# EAGLE design Werkstatt Provisions v.09 (EAGLE 6.2)

## Sheet 1 of 2
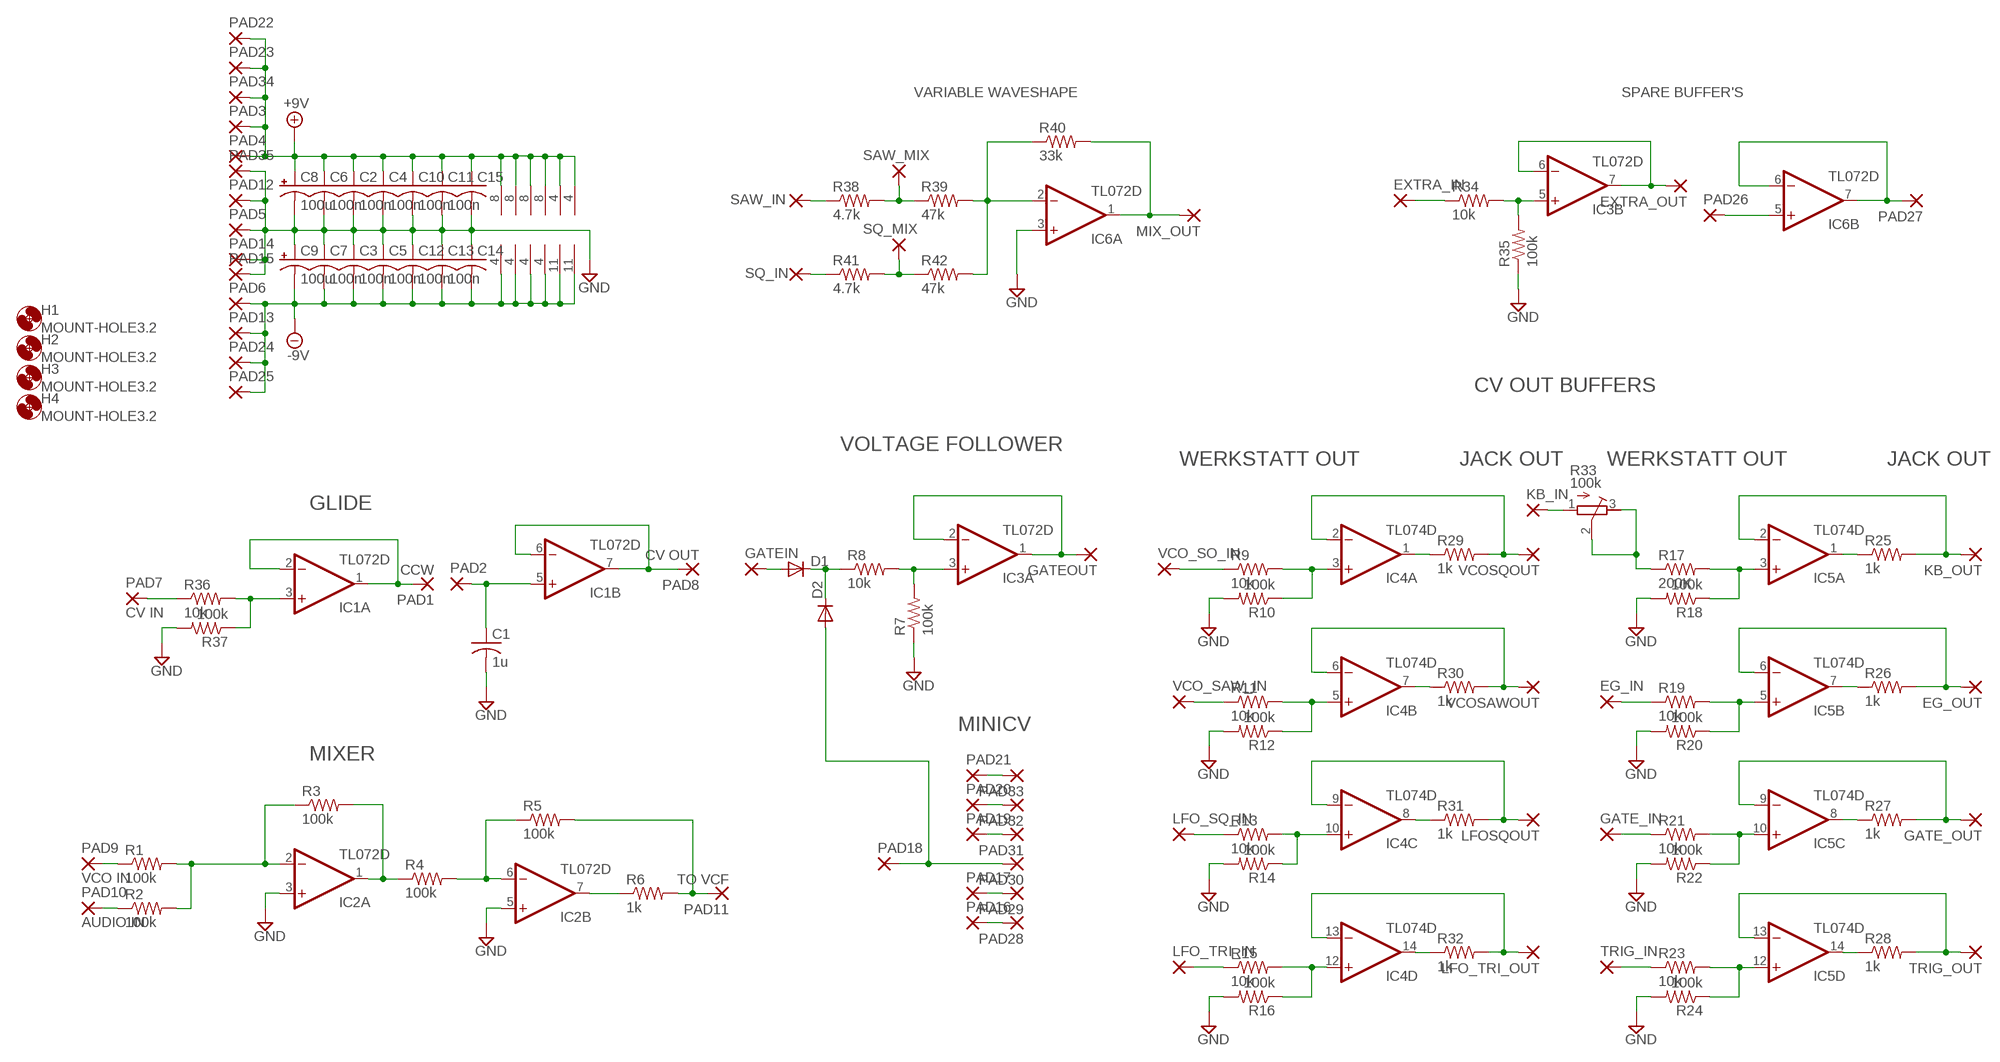
[diagram p0: schematic, sheet 1]

### Parts
C1  1u  C-USC0805K  [C0805K]
C2  100n  C-USC0805K  [C0805K]
C3  100n  C-USC0805K  [C0805K]
C4  100n  C-USC0805K  [C0805K]
C5  100n  C-USC0805K  [C0805K]
C6  100n  C-USC0805K  [C0805K]
C7  100n  C-USC0805K  [C0805K]
C8  100u  CPOL-USD  [PANASONIC_D]
C9  100u  CPOL-USD  [PANASONIC_D]
C10  100n  C-USC0805K  [C0805K]
C11  100n  C-USC0805K  [C0805K]
C12  100n  C-USC0805K  [C0805K]
C13  100n  C-USC0805K  [C0805K]
C14  C-USC0805  [C0805]
C15  C-USC0805  [C0805]
D1  DIODE-SOD323-W  [SOD323-W]
D2  DIODE-SOD323-W  [SOD323-W]
EG_IN  2,0/0,9-O  [2,0/0,9-O]
EG_OUT  2,0/0,9-O  [2,0/0,9-O]
EXTRA_IN  2,0/0,9-O  [2,0/0,9-O]
EXTRA_OUT  2,0/0,9-O  [2,0/0,9-O]
GATE_IN  2,0/0,9-O  [2,0/0,9-O]
GATE_OUT  2,0/0,9-O  [2,0/0,9-O]
GATEIN  2,0/0,9-O  [2,0/0,9-O]
GATEOUT  2,0/0,9-O  [2,0/0,9-O]
H1  MOUNT-HOLE3.2  [3,2]
H2  MOUNT-HOLE3.2  [3,2]
H3  MOUNT-HOLE3.2  [3,2]
H4  MOUNT-HOLE3.2  [3,2]
IC1  TL072D  [SO08]
IC2  TL072D  [SO08]
IC3  TL072D  [SO08]
IC4  TL074D  [SO14]
IC5  TL074D  [SO14]
IC6  TL072D  [SO08]
KB_IN  2,0/0,9-O  [2,0/0,9-O]
KB_OUT  2,0/0,9-O  [2,0/0,9-O]
LFO_SQ_IN  2,0/0,9-O  [2,0/0,9-O]
LFO_TRI_IN  2,0/0,9-O  [2,0/0,9-O]
LFO_TRI_OUT  2,0/0,9-O  [2,0/0,9-O]
LFOSQOUT  2,0/0,9-O  [2,0/0,9-O]
MIX_OUT  2,0/0,9-O  [2,0/0,9-O]
PAD1  CCW  2,0/0,9-O  [2,0/0,9-O]
PAD2  2,0/0,9-O  [2,0/0,9-O]
PAD3  2,0/0,9-O  [2,0/0,9-O]
PAD4  2,0/0,9-O  [2,0/0,9-O]
PAD5  2,0/0,9-O  [2,0/0,9-O]
PAD6  2,0/0,9-O  [2,0/0,9-O]
PAD7  CV IN  2,0/0,9-O  [2,0/0,9-O]
PAD8  CV OUT  2,0/0,9-O  [2,0/0,9-O]
PAD9  VCO IN  2,0/0,9-O  [2,0/0,9-O]
PAD10  AUDIO IN  2,0/0,9-O  [2,0/0,9-O]
PAD11  TO VCF  2,0/0,9-O  [2,0/0,9-O]
PAD12  2,0/0,9-O  [2,0/0,9-O]
PAD13  2,0/0,9-O  [2,0/0,9-O]
PAD14  2,0/0,9-O  [2,0/0,9-O]
PAD15  2,0/0,9-O  [2,0/0,9-O]
PAD16  2,0/0,9-O  [2,0/0,9-O]
PAD17  2,0/0,9-O  [2,0/0,9-O]
PAD18  2,0/0,9-O  [2,0/0,9-O]
PAD19  2,0/0,9-O  [2,0/0,9-O]
PAD20  2,0/0,9-O  [2,0/0,9-O]
PAD21  2,0/0,9-O  [2,0/0,9-O]
PAD22  2,0/0,9-O  [2,0/0,9-O]
PAD23  2,0/0,9-O  [2,0/0,9-O]
PAD24  2,0/0,9-O  [2,0/0,9-O]
PAD25  2,0/0,9-O  [2,0/0,9-O]
PAD26  2,0/0,9-O  [2,0/0,9-O]
PAD27  2,0/0,9-O  [2,0/0,9-O]
PAD28  1,6/0,8  [1,6/0,8]
PAD29  1,6/0,8  [1,6/0,8]
PAD30  1,6/0,8  [1,6/0,8]
PAD31  1,6/0,8  [1,6/0,8]
PAD32  1,6/0,8  [1,6/0,8]
PAD33  1,6/0,8  [1,6/0,8]
PAD34  1,6/0,8  [1,6/0,8]
PAD35  1,6/0,8  [1,6/0,8]
R1  100k  R-US_M0805  [M0805]
R2  100k  R-US_M0805  [M0805]
R3  100k  R-US_M0805  [M0805]
R4  100k  R-US_M0805  [M0805]
R5  100k  R-US_M0805  [M0805]
R6  1k  R-US_M0805  [M0805]
R7  100k  R-US_M0805  [M0805]
R8  10k  R-US_M0805  [M0805]
R9  10k  R-US_M0805  [M0805]
R10  100k  R-US_M0805  [M0805]
R11  10k  R-US_M0805  [M0805]
R12  100k  R-US_M0805  [M0805]
R13  10k  R-US_M0805  [M0805]
R14  100k  R-US_M0805  [M0805]
R15  10k  R-US_M0805  [M0805]
R16  100k  R-US_M0805  [M0805]
R17  200K  R-US_M0805  [M0805]
R18  100k  R-US_M0805  [M0805]
R19  10k  R-US_M0805  [M0805]
R20  100k  R-US_M0805  [M0805]
R21  10k  R-US_M0805  [M0805]
R22  100k  R-US_M0805  [M0805]
R23  10k  R-US_M0805  [M0805]
R24  100k  R-US_M0805  [M0805]
R25  1k  R-US_M0805  [M0805]
R26  1k  R-US_M0805  [M0805]
R27  1k  R-US_M0805  [M0805]
R28  1k  R-US_M0805  [M0805]
R29  1k  R-US_M0805  [M0805]
R30  1k  R-US_M0805  [M0805]
R31  1k  R-US_M0805  [M0805]
R32  1k  R-US_M0805  [M0805]
R33  100k  R-TRIMM3202  [RTRIM3202]
R34  10k  R-US_M0805  [M0805]
R35  100k  R-US_M0805  [M0805]
R36  10k  R-US_M0805  [M0805]
R37  100k  R-US_M0805  [M0805]
R38  4.7k  R-US_R0805  [R0805]
R39  47k  R-US_R0805  [R0805]
R40  33k  R-US_R0805  [R0805]
R41  4.7k  R-US_R0805  [R0805]
R42  47k  R-US_R0805  [R0805]
SAW_IN  2,0/0,9-O  [2,0/0,9-O]
SAW_MIX  2,0/0,9-O  [2,0/0,9-O]
SQ_IN  2,0/0,9-O  [2,0/0,9-O]
SQ_MIX  2,0/0,9-O  [2,0/0,9-O]
TRIG_IN  2,0/0,9-O  [2,0/0,9-O]
TRIG_OUT  2,0/0,9-O  [2,0/0,9-O]
VCO_SAW_IN  2,0/0,9-O  [2,0/0,9-O]
VCO_SO_IN  2,0/0,9-O  [2,0/0,9-O]
VCOSAWOUT  2,0/0,9-O  [2,0/0,9-O]
VCOSQOUT  2,0/0,9-O  [2,0/0,9-O]

### Nets
+9V: C2.1 C4.1 C6.1 C8.+ C10.1 C11.1 C15.1 IC1.8(P:V+) IC2.8(P:V+) IC3.8(P:V+) IC4.4(P:V+) IC5.4(P:V+) IC6.8(P:V+) PAD3.1(P) PAD4.1(P) PAD22.1(P) PAD23.1(P) PAD34.1(P)
-9V: C3.2 C5.2 C7.2 C9.- C12.2 C13.2 C14.2 IC1.4(P:V-) IC2.4(P:V-) IC3.4(P:V-) IC4.11(P:V-) IC5.11(P:V-) IC6.4(P:V-) PAD6.1(P) PAD13.1(P) PAD24.1(P) PAD25.1(P)
GATE_IN_MIDI: D2.A PAD18.1(P) PAD30.1(P)
GND: C1.2 C2.2 C3.1 C4.2 C5.1 C6.2 C7.1 C8.- C9.+ C10.2 C11.2 C12.1 C13.1 C14.1 C15.2 IC2.3(A:+IN) IC2.5(B:+IN) IC6.3(A:+IN) PAD5.1(P) PAD12.1(P) PAD14.1(P) PAD15.1(P) PAD35.1(P) R7.1 R10.2 R12.2 R14.2 R16.2 R18.2 R20.2 R22.2 R24.2 R35.1 R37.2
LSW: D1.A GATEIN.1(P)
N$1: IC1.1(A:OUT) IC1.2(A:-IN) PAD1.1(P)
N$2: PAD7.1(P) R36.1
N$3: C1.1 IC1.5(B:+IN) PAD2.1(P)
N$4: IC1.6(B:-IN) IC1.7(B:OUT) PAD8.1(P)
N$5: IC2.2(A:-IN) R1.2 R2.2 R3.1
N$6: PAD16.1(P) PAD28.1(P)
N$7: IC2.1(A:OUT) R3.2 R4.1
N$8: IC2.6(B:-IN) R4.2 R5.1
N$9: PAD11.1(P) R5.2 R6.2
N$10: IC2.7(B:OUT) R6.1
N$11: PAD9.1(P) R1.1
N$12: PAD10.1(P) R2.1
N$13: IC3.5(B:+IN) R34.2 R35.2
N$14: IC3.3(A:+IN) R7.2 R8.2
N$15: PAD17.1(P) PAD29.1(P)
N$16: GATEOUT.1(P) IC3.1(A:OUT) IC3.2(A:-IN)
N$17: PAD19.1(P) PAD31.1(P)
N$18: PAD20.1(P) PAD32.1(P)
N$19: PAD21.1(P) PAD33.1(P)
N$20: D1.C D2.C R8.1
N$21: IC1.3(A:+IN) R36.2 R37.1
N$22: R9.1 VCO_SO_IN.1(P)
N$23: IC4.3(A:+IN) R9.2 R10.1
N$24: EG_IN.1(P) R19.1
N$25: R11.1 VCO_SAW_IN.1(P)
N$26: IC4.5(B:+IN) R11.2 R12.1
N$27: IC4.2(A:-IN) R29.2 VCOSQOUT.1(P)
N$28: IC4.6(B:-IN) R30.2 VCOSAWOUT.1(P)
N$29: IC4.9(C:-IN) LFOSQOUT.1(P) R31.2
N$30: IC4.13(D:-IN) LFO_TRI_OUT.1(P) R32.2
N$31: IC5.2(A:-IN) KB_OUT.1(P) R25.2
N$32: EG_OUT.1(P) IC5.6(B:-IN) R26.2
N$33: GATE_OUT.1(P) IC5.9(C:-IN) R27.2
N$34: IC5.13(D:-IN) R28.2 TRIG_OUT.1(P)
N$35: LFO_TRI_IN.1(P) R15.1
N$36: IC4.14(D:OUT) R32.1
N$37: LFO_SQ_IN.1(P) R13.1
N$38: IC4.10(C:+IN) R13.2 R14.1
N$39: IC4.12(D:+IN) R15.2 R16.1
N$40: IC4.8(C:OUT) R31.1
N$41: IC4.1(A:OUT) R29.1
N$42: IC4.7(B:OUT) R30.1
N$43: IC5.5(B:+IN) R19.2 R20.1
N$44: IC5.10(C:+IN) R21.2 R22.1
N$45: GATE_IN.1(P) R21.1
N$46: R23.1 TRIG_IN.1(P)
N$47: R17.1 R33.2(S) R33.3(A)
N$48: IC5.3(A:+IN) R17.2 R18.1
N$49: IC5.12(D:+IN) R23.2 R24.1
N$50: IC5.14(D:OUT) R28.1
N$51: IC5.8(C:OUT) R27.1
N$52: IC5.7(B:OUT) R26.1
N$53: IC5.1(A:OUT) R25.1
N$54: KB_IN.1(P) R33.1(E)
N$55: EXTRA_IN.1(P) R34.1
N$56: IC6.2(A:-IN) R39.2 R40.1 R42.2
N$57: EXTRA_OUT.1(P) IC3.6(B:-IN) IC3.7(B:OUT)
N$58: R41.2 R42.1 SQ_MIX.1(P)
N$59: R41.1 SQ_IN.1(P)
N$60: R38.2 R39.1 SAW_MIX.1(P)
N$61: R38.1 SAW_IN.1(P)
N$62: IC6.1(A:OUT) MIX_OUT.1(P) R40.2
N$63: IC6.6(B:-IN) IC6.7(B:OUT) PAD27.1(P)
N$64: IC6.5(B:+IN) PAD26.1(P)

### Notes on the sheet
- VARIABLE WAVESHAPE | SPARE BUFFER'S
- CV OUT BUFFERS
- VOLTAGE FOLLOWER
- WERKSTATT OUT | JACK OUT | WERKSTATT OUT | JACK OUT
- GLIDE
- MINICV
- MIXER

## Sheet 2 of 2

## Library data of the parts
C1-C7 C10-C15 = resistor:C-US: CAPACITOR, American symbol
C8 C9 = resistor:CPOL-US: POLARIZED CAPACITOR, American symbol
D1 D2 = diode:DIODE-: DIODE
EG_IN EG_OUT EXTRA_IN EXTRA_OUT GATE_IN GATE_OUT GATEIN GATEOUT KB_IN KB_OUT LFO_SQ_IN LFO_TRI_IN LFO_TRI_OUT LFOSQOUT MIX_OUT PAD1-PAD27 SAW_IN SAW_MIX SQ_IN SQ_MIX TRIG_IN TRIG_OUT VCO_SAW_IN VCO_SO_IN VCOSAWOUT VCOSQOUT = synthdiy:2,0/0,9-O: OCT THROUGH-HOLE PAD 2.0 mm, 0.9 mm/0.079",0.035"
H1-H4 = holes:MOUNT-HOLE: MOUNTING HOLE with drill center marker
IC1-IC3 IC6 = linear:TL072: OP AMP
IC4 IC5 = linear:TL074: OP AMP
PAD28-PAD35 = wirepad:1,6/0,8: THROUGH-HOLE PAD
R1-R32 R34-R42 = resistor:R-US_: RESISTOR, American symbol
R33 = resistor:R-TRIMM: Trimm resistor

## Board
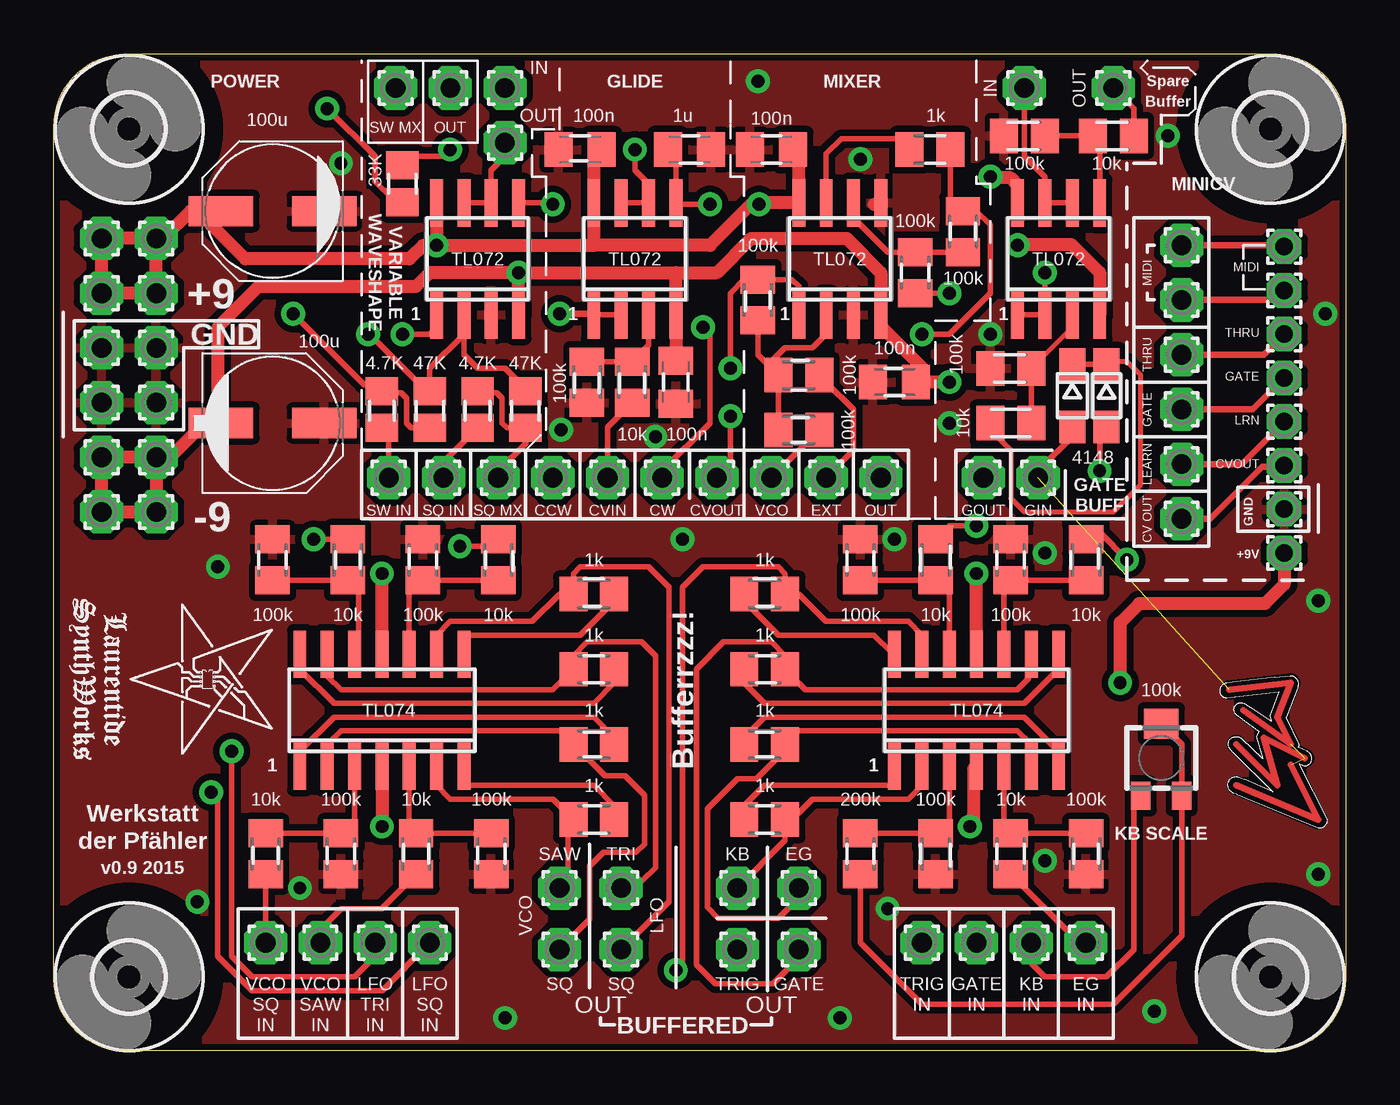
[diagram p1: board, top side]
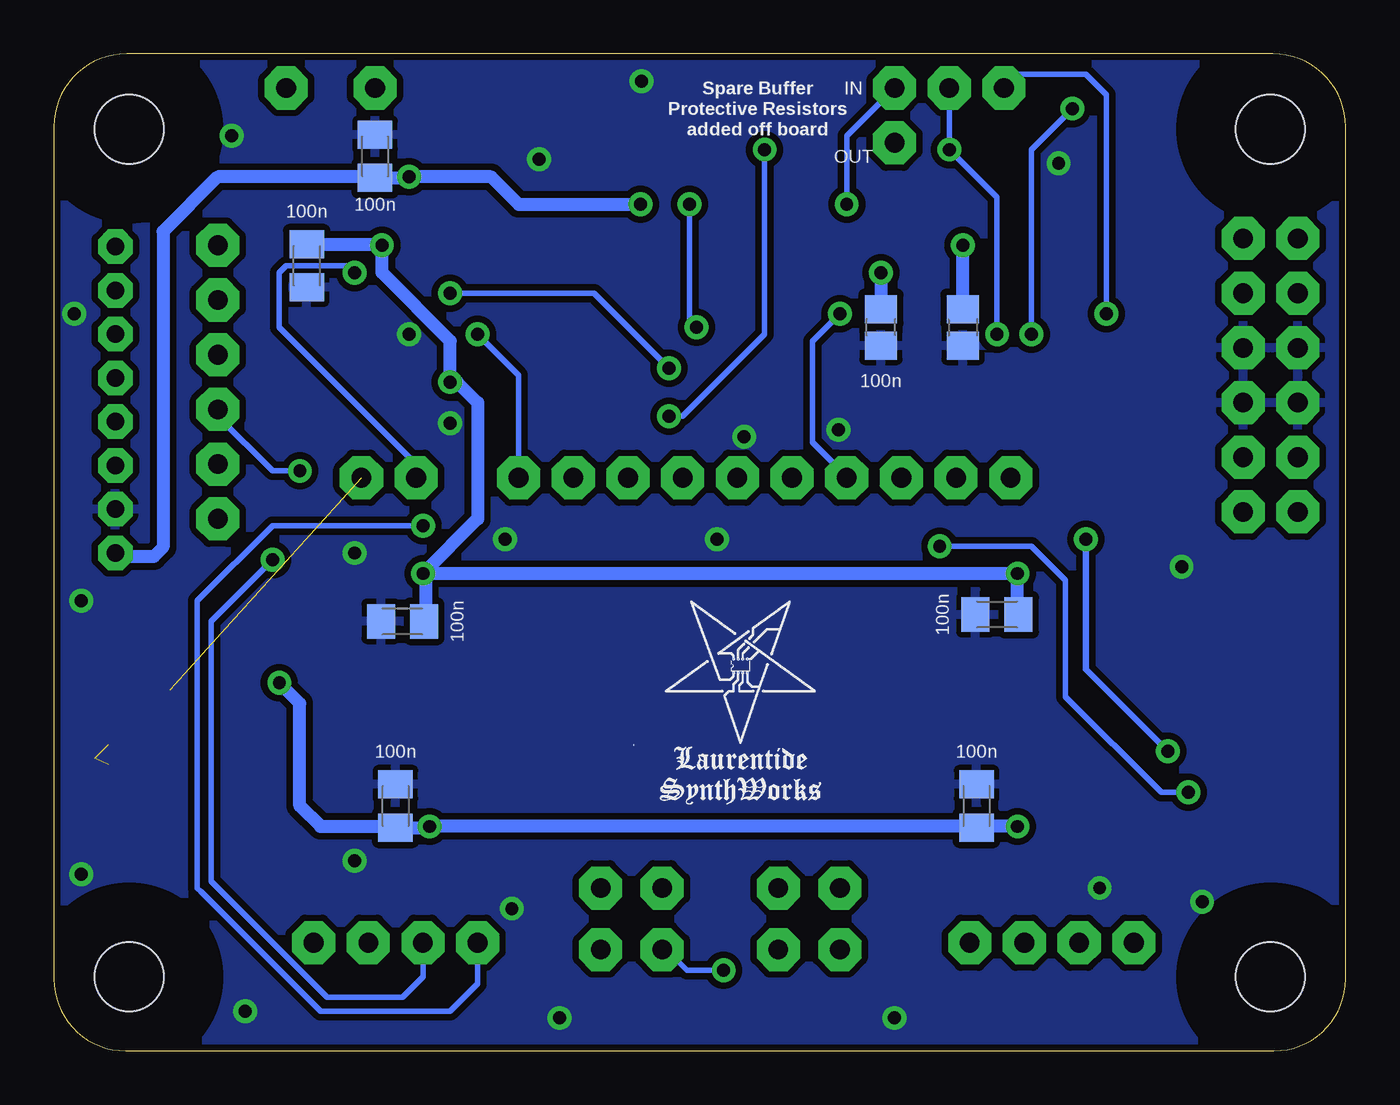
[diagram p2: board, bottom side, seen from below]

Size 60.01 x 46.29 mm. Coordinates in mm from the lower left corner, seen from the top.
Outline: 56.67,0 3.33,0 arc-90 0,3.33 0,42.92 arc-90 3.38,46.29 56.63,46.29 arc-90 60.01,42.92 60.01,3.33 arc-90 56.67,0
Copper layers (1*16): Top 0.035mm / dielectric 1.5mm / Bottom 0.035mm
Design rules: minimum track width 6mil, minimum drill 20mil, track to track 6mil, track to pad 6mil, pad to pad 6mil, via to via 6mil, smd to smd 6mil, copper to edge 10mil, drill to drill 10mil, minimum pad ring 12mil, minimum via ring 10mil, stop-mask expansion 4mil, vias tented up to drill 25mil, thermal gap 10mil

### Footprints (pad centres in the part's own frame; a part is rotated, then mirrored left to right if it is on the bottom)
C0805K = smd 1.3 x 1.6: 1 -1,0; 2 1,0
PANASONIC_D = smd 3 x 1.4: + 2.4,0; - -2.4,0
C0805 = smd 1.3 x 1.5: 1 -0.85,0; 2 0.85,0
SOD323-W = smd 1.5 x 1.2: A 1.45,0; C -1.45,0
2,0/0,9-O = drill 0.914 pad 2 octagon: 1 0,0
3,2 = hole 3.2: 0,0
SO08 = smd 0.6 x 2.2: 1 -1.905,-2.6; 2 -0.635,-2.6; 3 0.635,-2.6; 4 1.905,-2.6; 5 1.905,2.6; 6 0.635,2.6; 7 -0.635,2.6; 8 -1.905,2.6
SO14 = smd 0.6 x 2.2: 1 -3.81,-2.6; 2 -2.54,-2.6; 3 -1.27,-2.6; 4 0,-2.6; 5 1.27,-2.6; 6 2.54,-2.6; 7 3.81,-2.6; 8 3.81,2.6; 9 2.54,2.6; 10 1.27,2.6; 11 0,2.6; 12 -1.27,2.6; 13 -2.54,2.6; 14 -3.81,2.6
1,6/0,8 = drill 0.813 pad 1.6 octagon: 1 0,0
M0805 = smd 1.3 x 1.6: 1 -0.95,0; 2 0.95,0
RTRIM3202 = smd 0.9 x 1.3: 1 -0.95,-1.75; 3 0.95,-1.75 | smd 1.6 x 1.4: 2 0,1.6
R0805 = smd 1.3 x 1.5: 1 -0.85,0; 2 0.85,0

### Placement (x,y rotation side)
C1  29.53,41.85 0 top
C2  24.45,41.85 180 top
C3  28.89,31.05 90 top
C4  33.34,41.85 180 top
C5  39.05,31.05 0 top
C6  45.09,41.53 90 bottom
C7  48.26,36.45 90 bottom
C8  10.16,38.99 180 top
C9  10.16,29.15 0 top
C10  44.13,11.37 90 bottom
C11  17.15,11.37 90 bottom
C12  16.19,20.26 0 bottom
C13  43.81,19.94 0 bottom
C14  21.59,33.59 90 bottom
C15  17.78,33.59 270 bottom
D1  47.31,30.42 270 top
D2  48.89,30.42 270 top
EG_IN  47.94,5.02 0 top
EG_OUT  34.61,7.56 0 top
EXTRA_IN  49.21,44.7 0 top
EXTRA_OUT  45.09,44.7 0 top
GATE_IN  42.86,5.02 0 top
GATE_OUT  34.61,4.7 0 top
GATEIN  45.72,26.61 0 top
GATEOUT  43.18,26.61 0 top
H1  3.49,3.43 0 top
H2  56.52,3.43 0 top
H3  56.52,42.8 0 top
H4  3.49,42.8 0 top
IC1  26.99,36.77 0 top
IC2  36.51,36.77 0 top
IC3  46.67,36.77 0 top
IC4  15.24,15.81 0 top
IC5  42.86,15.81 0 top
IC6  19.69,36.77 0 top
KB_IN  45.4,5.02 0 top
KB_OUT  31.75,7.56 0 top
LFO_SQ_IN  17.46,5.02 0 top
LFO_TRI_IN  14.92,5.02 0 top
LFO_TRI_OUT  26.35,7.56 0 top
LFOSQOUT  26.35,4.7 0 top
MIX_OUT  18.42,44.7 0 top
PAD1  23.18,26.61 0 top
PAD2  28.26,26.61 0 top
PAD3  4.76,37.72 0 top
PAD4  4.76,35.18 0 top
PAD5  4.76,32.64 90 top
PAD6  4.76,25.02 0 top
PAD7  25.72,26.61 0 top
PAD8  30.8,26.61 0 top
PAD9  33.34,26.61 0 top
PAD10  35.88,26.61 0 top
PAD11  38.42,26.61 0 top
PAD12  4.76,30.1 0 top
PAD13  4.76,27.56 0 top
PAD14  2.22,32.64 0 top
PAD15  2.22,30.1 0 top
PAD16  52.39,24.7 180 top
PAD17  52.39,27.24 180 top
PAD18  52.39,29.78 180 top
PAD19  52.39,32.32 180 top
PAD20  52.39,34.86 180 top
PAD21  52.39,37.4 180 top
PAD22  2.22,37.72 0 top
PAD23  2.22,35.18 0 top
PAD24  2.22,27.56 0 top
PAD25  2.22,25.02 0 top
PAD26  20.96,44.7 0 top
PAD27  20.96,42.16 0 top
PAD28  57.15,27.18 0 top
PAD29  57.15,29.21 0 top
PAD30  57.15,31.24 0 top
PAD31  57.15,33.27 0 top
PAD32  57.15,35.31 0 top
PAD33  57.15,37.34 0 top
PAD34  57.15,23.11 0 top
PAD35  57.15,25.15 0 top
R1  34.61,28.83 180 top
R2  34.61,31.37 180 top
R3  32.7,34.86 90 top
R4  40.01,36.13 90 top
R5  42.23,38.04 90 top
R6  40.7,41.85 0 top
R7  44.45,31.69 0 top
R8  44.45,29.15 0 top
R9  9.84,9.14 90 top
R10  13.34,9.14 270 top
R11  16.83,9.14 90 top
R12  20.32,9.14 270 top
R13  20.64,22.8 270 top
R14  17.15,22.8 90 top
R15  13.65,22.8 270 top
R16  10.16,22.8 90 top
R17  37.47,9.14 90 top
R18  40.96,9.14 270 top
R19  44.45,9.14 90 top
R20  47.94,9.14 270 top
R21  47.94,22.8 270 top
R22  44.45,22.8 90 top
R23  40.96,22.8 270 top
R24  37.47,22.8 90 top
R25  33.02,10.73 0 top
R26  33.02,14.22 0 top
R27  33.02,17.72 0 top
R28  33.02,21.21 0 top
R29  25.08,14.22 180 top
R30  25.08,10.73 180 top
R31  25.08,21.21 180 top
R32  25.08,17.72 180 top
R33  51.44,13.59 0 top
R34  49.21,42.48 180 top
R35  45.09,42.48 0 top
R36  26.86,31.05 90 top
R37  24.77,31.05 270 top
R38  15.24,29.78 90 top
R39  17.46,29.78 90 top
R40  16.19,40.26 90 top
R41  19.69,29.78 90 top
R42  21.91,29.78 90 top
SAW_IN  15.56,26.61 0 top
SAW_MIX  15.88,44.7 0 top
SQ_IN  18.1,26.61 0 top
SQ_MIX  20.64,26.61 0 top
TRIG_IN  40.32,5.02 0 top
TRIG_OUT  31.75,4.7 0 top
VCO_SAW_IN  12.38,5.02 0 top
VCO_SO_IN  9.84,5.02 0 top
VCOSAWOUT  23.5,7.56 0 top
VCOSQOUT  23.5,4.7 0 top

### Tracks (layer width: path | path; a pad name or v marks a point on that pad's centre or on a via)
+9V  (via drill 0.6)
  Top 0.61: C2.1 25.08,41.48 IC1.8 25.08,37.4 | C4.1 34.61,41.58 IC2.8 32.76,39.37 v32.76,39.31 32.39,39.31 30.48,37.4 25.08,37.4 | v42.55,10.41 42.74,10.6 42.74,13.08 IC5.4 | 15.43,10.6 v15.24,10.41 IC4.4 | IC3.8 44.77,40.21 44.45,40.53 43.55,40.53 v43.5,40.58 | v17.78,37.4 25.08,37.4 | PAD3.1 PAD4.1 PAD23.1 PAD22.1 PAD3.1 | 7.94,39.13 C8.+ | IC6.8 v17.78,37.4 | v49.53,17.08 49.53,19.88 50.42,20.76 56.26,20.76 57.15,21.65 PAD34.1 | v17.78,37.4 17.15,37.4 16.51,36.77 8.89,36.77 7.3,38.35 7.3,38.53 C8.+ | PAD3.1 5.08,37.72 6.35,38.99 C8.+
  Bottom 0.61: v32.76,39.31 38.42,39.31 39.69,40.58 v43.5,40.58 43.55,40.53 C6.1 45.13,40.58 52.39,40.58 54.93,38.04 54.93,23.39 55.37,22.95 56.99,22.95 PAD34.1 | C11.1 17.1,10.41 v15.24,10.41 v42.55,10.41 42.59,10.37 C10.1 44.18,10.41 47.62,10.41 48.58,11.37 48.58,16.13 v49.53,17.08 | C15.1 v17.78,37.4
-9V  (via drill 0.6)
  Top 0.254: 15.24,18.67 IC4.11 15.24,18.35
  Top 0.406: 38.42,33.64 IC2.4
  Top 0.61: 28.89,36.13 30.8,36.13 32.39,37.72 36.83,37.72 38.42,36.13 IC2.4 | 28.89,36.13 IC1.4 C3.2 | 38.42,33.64 40.37,31.69 C5.2 v41.59,31.05 | 15.43,21.97 v15.24,22.16 15.24,18.35 | v44.77,37.4 44.81,37.45 47.26,37.45 48.58,36.13 IC3.4 | PAD13.1 PAD6.1 PAD25.1 PAD24.1 PAD13.1 | IC5.11 v42.86,22.16 | v21.59,36.13 28.89,36.13 | IC6.4 v21.59,36.13 | 7.62,29.29 7.62,33.59 9.53,35.5 16.83,35.5 17.46,36.13 v21.59,36.13 | 7.62,29.29 C9.- | 7.62,29.29 7.13,29.29 5.4,27.56 PAD13.1
  Bottom 0.61: v15.24,22.16 15.56,22.16 | C12.2 15.24,20.53 v15.24,22.16 | v42.86,22.16 42.74,22.35 42.74,20.45 arc45 C13.2 | C7.2 44.81,37.45 v44.77,37.4 44.77,36.13 41.59,32.96 v41.59,31.05 41.28,31.05 40.32,30.1 40.32,24.7 v42.86,22.16 | v15.24,22.16 v42.86,22.16 | v21.59,36.13 C14.2
GATE_IN_MIDI  (via drill 0.6)
  Top 0.254: v48.58,26.92 48.58,28.65 D2.A
  Top 0.305: PAD18.1 55.69,29.78 PAD30.1
  Bottom 0.254: PAD18.1 52.39,29.46 49.85,26.92 v48.58,26.92
GND  (via drill 0.6)
  Top 0.61: IC2.5 38.42,39.31 | 38.42,38.99 38.42,39.31 | 38.42,39.31 38.1,39.31 | C5.1 38.1,31.37
  other vias: 27.94,28.51 37.47,41.4 11.43,7.56 43.5,33.27 20.96,1.52 46.04,8.83 23.56,28.83 32.7,45.02 7.62,22.48 6.67,6.92 36.51,1.52 39.05,23.75 29.21,23.75 51.12,1.84 51.75,42.48 41.59,29.15 13.34,41.21 38.73,6.6 59.06,34.23 58.74,20.89 58.74,8.19 46.04,23.11
  pour Top (isolate 0.305): -0.95,10.41 -1.27,5.65 -1.27,-0.06 arc-90 5.4,0.25 6.67,-0.06 53.98,-0.06 53.98,3.11 arc-90 57.78,6.92 60.01,6.92 60.01,39.62 58.1,39.62 arc-90 53.66,44.07 53.66,46.29 6.35,46.29 6.35,44.7 arc-90 2.22,40.58 0,40.58
  pour Bottom (isolate 0.305): 53.98,-0.06 53.98,3.11 arc-90 57.78,6.92 60.01,6.92 60.01,39.62 58.1,39.62 arc-90 53.66,44.07 53.66,46.29 6.35,46.29 6.35,44.7 arc-90 2.22,40.58 0,40.58 -1.27,6.29 -1.27,-0.06 arc-90 6.03,-0.06
LSW  (3 unrouted)
  Top 0.254: 47.62,28.83 D1.A 47.31,28.51 45.86,27.06 45.72,27.06 GATEIN.1
  Top 0.305: 54.93,14.22 56.83,12.32 56.2,14.54 58.1,13.59 | 54.93,12.32 58.74,10.73 57.47,13.27 | 55.25,15.81 57.47,14.22 56.83,15.49 57.47,17.08 54.61,16.76
N$1  (via drill 0.6)
  Top 0.254: IC1.1 IC1.2
  Top 0.305: v23.5,34.23 25.02,34.23 IC1.1
  Bottom 0.254: PAD1.1 23.24,26.67 23.24,26.73 24.77,28.26 24.77,32.96 v23.5,34.23
N$2
  Top 0.254: PAD7.1 25.72,28.96 R36.1
N$3  (via drill 0.6)
  Top 0.254: C1.1 28.89,41.48 IC1.5 28.95,39.31 v30.48,39.31 | v30.16,33.59 30.48,33.27 30.48,29.15 28.26,26.92 PAD2.1
  Bottom 0.254: v30.48,39.31 30.48,33.91 v30.16,33.59
N$4  (via drill 0.6)
  Top 0.254: IC1.7 IC1.6 27.62,40.26 26.99,40.89 v26.99,41.85 | v31.43,29.46 31.43,27.24 PAD8.1
  Bottom 0.254: v26.99,41.85 26.99,33.27 30.8,29.46 v31.43,29.46
N$5
  Top 0.254: R1.2 R2.2 | IC2.2 35.88,33.27 35.24,32.64 33.97,32.64 33.18,31.85 | R3.1 32.7,32.32 33.18,31.85 | 33.18,31.85 R2.2 | R2.2
N$6
  Top 0.305: PAD16.1 53.72,24.7 56.13,27.11 57.09,27.11 PAD28.1
N$7  (via drill 0.6)
  Top 0.254: IC2.1 34.61,35.5 34.29,35.81 R3.2 32.07,35.81 31.43,35.18 v31.43,31.69 | 40.32,34.86 R4.1 v41.59,35.18
  Bottom 0.254: v41.59,35.18 34.92,35.18 v31.43,31.69
N$8
  Top 0.152: 40.64,36.77 R4.2
  Top 0.254: 40.33,37.09 R4.2 | R4.2 38.74,37.08 37.15,38.67 IC2.6 | R5.1 R4.2
N$9  (via drill 0.6)
  Top 0.254: v40.32,33.27 41.59,33.27 43.5,35.18 43.5,38.35 42.87,38.99 R5.2 41.65,39.56 R6.2
  Bottom 0.254: PAD11.1 38.42,31.37 v40.32,33.27
N$10
  Top 0.254: IC2.7 35.88,41.66 36.58,42.35 39.25,42.35 R6.1
N$11
  Top 0.254: PAD9.1 R1.1
N$12
  Top 0.254: PAD10.1 37.15,27.88 37.15,29.78 35.88,31.05 R2.1
N$13
  Top 0.254: R35.2 R34.2 48.58,42.17 IC3.5
N$14
  Top 0.203: 45.72,31.69 45.72,32.01 47.31,33.59
  Top 0.254: IC3.3 47.31,33.59 47.31,33.27 | R7.2 | R7.2 45.72,31.69 | R8.2 R7.2
N$15
  Top 0.305: PAD17.1 55.18,27.24 PAD29.1
N$16  (via drill 0.6)
  Top 0.254: IC3.1 IC3.2 v46.04,36.13
  Bottom 0.254: GATEOUT.1 43.18,27.24 49.53,33.59 49.53,36.13 49.21,36.45 46.36,36.45 v46.04,36.13
N$17
  Top 0.305: PAD19.1 56.2,32.32 PAD31.1
N$18
  Top 0.305: PAD20.1 56.71,34.86 PAD32.1
N$19
  Top 0.305: PAD21.1 57.09,37.4 PAD33.1
N$20
  Top 0.229: 43.5,28.83 44.45,27.88 44.45,25.65 45.09,25.02 49.21,25.02 50.48,26.29 50.48,31.37 49.85,32 49.03,32 D2.C
  Top 0.254: R8.1 43.5,28.83 | D2.C D1.C
N$21
  Top 0.254: R36.2 26.35,32 | IC1.3 27.62,32.76 R36.2 | R36.2 R37.1
N$22
  Top 0.254: VCO_SO_IN.1 R9.1
N$23
  Top 0.254: R9.2 R10.1 13.97,10.73 IC4.3
N$24
  Top 0.254: EG_IN.1 47.63,5.02 R19.1
N$25
  Top 0.254: R11.1 15.24,6.6 13.34,6.6 12.38,5.65 VCO_SAW_IN.1
N$26
  Top 0.254: R12.1 R11.2 16.51,10.41 IC4.5 | R12.1 20.95,10.09 20.96,10.1 R12.1
N$27
  Top 0.254: IC4.2 12.7,14.22 13.34,14.86 23.5,14.86 R29.2 25.59,12.76 26.54,12.76 27.43,11.87 27.43,9.59 27.05,9.21 25.53,9.21 24.89,8.57 24.89,6.1 VCOSQOUT.1
N$28
  Top 0.254: R30.2 23.18,11.68 18.42,11.68 17.78,12.32 IC4.6 | R30.2 | VCOSAWOUT.1 23.5,7.81 23.88,8.19 23.88,10.48 R30.2
N$29
  Top 0.254: IC4.9 17.78,19.3 18.42,19.94 22.23,19.94 23.5,21.21 R31.2 24.13,22.16 24.45,22.48 27.62,22.48 28.58,21.53 28.58,6.92 LFOSQOUT.1
N$30
  Top 0.254: IC4.13 12.7,17.4 13.34,16.76 23.18,16.76 R32.2 24.13,18.35 24.77,18.99 27.3,18.99 27.94,18.35 27.94,8.51 27.3,7.87 26.67,7.87 LFO_TRI_OUT.1
N$31
  Top 0.254: IC5.2 40.32,12.32 39.69,11.68 35.24,11.68 34.29,10.73 R25.2 33.97,9.78 KB_OUT.1
N$32
  Top 0.254: R26.2 34.61,14.86 44.77,14.86 45.4,14.22 IC5.6 | R26.2 34.29,14.22 33.97,13.91 | EG_OUT.1 34.61,7.11 33.66,6.16 30.86,6.16 30.35,6.67 30.35,11.24 31.75,12.64 32.64,12.64 33.66,13.65 33.66,13.91 R26.2
N$33
  Top 0.254: IC5.9 45.28,17.91 45.28,17.27 44.77,16.76 34.92,16.76 R27.2 33.97,18.35 33.34,18.99 31.12,18.99 29.85,17.72 29.85,4 30.73,3.11 33.4,3.11 34.61,4.32 GATE_OUT.1
N$34  (via drill 0.6)
  Top 0.254: v28.89,3.75 29.21,4.06 29.21,21.53 30.16,22.48 33.66,22.48 33.97,22.16 R28.2 34.61,21.21 35.88,19.94 39.69,19.94 40.32,19.3 IC5.13
  Bottom 0.254: TRIG_OUT.1 31.56,4.7 30.61,3.75 v28.89,3.75
N$35  (via drill 0.6)
  Top 0.254: LFO_TRI_IN.1 14.92,4.38 13.97,3.43 9.21,3.43 8.26,4.38 v8.26,13.91 | 14.29,23.43 13.97,23.43 R15.1 12.7,23.75 v12.07,23.75
  Bottom 0.305: v12.07,23.75 12.07,17.72 v8.26,13.91
N$36
  Top 0.254: R32.1 26.03,17.08 25.08,16.13 13.02,16.13 11.43,17.72 IC4.14
N$37  (via drill 0.6)
  Top 0.254: LFO_SQ_IN.1 15.24,2.79 9.21,2.79 7.62,4.38 7.62,11.68 v7.3,12 | 20.32,24.07 R13.1 20.32,23.43 v18.86,23.43
  Bottom 0.254: v7.3,12 8.57,12 13.02,16.45 13.02,21.84 14.61,23.43 v18.86,23.43
N$38
  Top 0.254: R13.2 R14.1 16.51,21.21 IC4.10
N$39
  Top 0.254: IC4.12 14.16,18.54 14.16,21.34 R15.2 R16.1
N$40
  Top 0.254: IC4.8 19.05,19.3 24.45,19.3 25.72,20.57 25.72,20.89 R31.1
N$41
  Top 0.254: R29.1 26.03,14.54 25.08,15.49 13.02,15.49 11.43,13.91 IC4.1
N$42
  Top 0.254: R30.1 26.03,11.37 25.08,12.32 19.05,12.32 IC4.7
N$43
  Top 0.254: IC5.5 44.13,10.41 R19.2 R20.1
N$44
  Top 0.254: 44.01,21.4 R22.1 | R22.1 R21.2 | IC5.10 44.13,21.53 R22.1
N$45  (via drill 0.6)
  Top 0.254: v49.85,22.8 48.58,24.07 48.26,24.07 R21.1
  Bottom 0.254: GATE_IN.1 42.86,3.43 43.81,2.48 47.31,2.48 52.7,7.87 52.7,19.94 v49.85,22.8
N$46  (via drill 0.6)
  Top 0.254: 40.96,24.07 R23.1 41.59,24.38 v42.86,24.38
  Bottom 0.254: TRIG_IN.1 40.32,3.11 41.59,1.84 47.62,1.84 53.18,7.4 53.34,7.56 53.34,20.89 49.85,24.38 v42.86,24.38
N$47
  Top 0.254: R33.2 52.39,14.24 R33.3 52.39,12.15 52.39,5.33 49.21,2.16 40.32,2.16 37.47,5.02 R17.1
N$48
  Top 0.254: IC5.3 41.59,10.41 41.27,10.09 R18.1 R17.2
N$49
  Top 0.254: IC5.12 41.47,18.47 41.59,18.35 41.59,21.21 R23.2 R24.1
N$50
  Top 0.254: IC5.14 38.93,18.47 | 38.93,18.47 39.05,18.35 | 38.93,18.47 38.1,19.3 33.66,19.3 32.39,20.57 32.39,20.89 R28.1
N$51
  Top 0.254: IC5.8 46.55,17.59 45.09,16.13 33.02,16.13 32.07,17.08 R27.1
N$52
  Top 0.254: IC5.7 46.55,14.03 45.09,15.49 33.02,15.49 32.39,14.86 32.39,14.54 R26.1
N$53
  Top 0.254: R25.1 32.07,11.37 33.02,12.32 39.05,12.32 IC5.1
N$54
  Top 0.254: KB_IN.1 45.4,4.06 46.04,3.43 48.89,3.43 50.17,4.7 50.17,11.84 R33.1
N$55
  Top 0.254: R34.1 50.16,43.75 EXTRA_IN.1
N$56  (via drill 0.6)
  Top 0.254: IC6.2 19.05,34.23 | v12.7,43.75 14.92,41.53 14.92,40.36 15.66,39.62 R40.1 | R42.2 21.91,30.73 20.96,31.69 19.69,31.69 19.05,32.32 19.05,33.27 17.46,31.69 R39.2 17.17,30.92 17.02,30.92 14.67,33.27 v14.61,33.27
  Top 0.305: 19.05,33.27 IC6.2
  Bottom 0.254: v12.7,43.75 14.61,41.85 v14.61,33.27
N$57
  Top 0.254: IC3.6 IC3.7 46.04,40.58 45.09,41.53 EXTRA_OUT.1
N$58
  Top 0.254: 19.9,30.42 R41.2 19.77,30.54 20.57,30.54 20.83,30.29 20.83,29.15 21.04,28.93 R42.1
  Top 0.305: SQ_MIX.1 20.64,26.92 21.91,28.19 R42.1
N$59
  Top 0.254: SQ_IN.1 18.1,27.34 R41.1
N$60  (via drill 0.6)
  Top 0.254: R39.1 16.6,28.93 16.38,29.15 16.38,30.29 16.13,30.54 15.33,30.54 R38.2
  Top 0.305: v11.11,34.23 14.39,30.95 14.92,30.95 R38.2
  Bottom 0.254: v11.11,34.23 11.11,44.39 12.07,45.34 15.24,45.34 SAW_MIX.1
N$61
  Top 0.254: SAW_IN.1 15.56,28.61 R38.1
  Top 0.305: 15.56,28.93 R38.1
N$62  (via drill 0.6)
  Top 0.254: v16.19,33.27 17.46,33.27 17.78,33.59 IC6.1 | R40.2 15.88,41.21 16.19,41.53 18.1,41.53 v18.42,41.85
  Top 0.305: 17.78,34.86 IC6.1
  Bottom 0.254: v16.19,33.27 16.19,39.62 v18.42,41.85 MIX_OUT.1
N$63
  Top 0.254: PAD27.1 20.96,41.53 20.32,40.89 IC6.6 IC6.7
N$64  (via drill 0.6)
  Top 0.254: IC6.5 23.12,39.37 v23.18,39.31
  Bottom 0.254: v23.18,39.31 23.18,42.48 PAD26.1

### Text on the board
tPlace: IN | POWER | GLIDE | MIXER | IN | OUT | Spare | OUT | 100n | 1u | 1k | Buffer | 100u | SW MX | OUT | 100n | 33K | 100k | 10k | MINICV | 100k | 100k | TL072 | TL072 | TL072 | TL072 | MIDI | WAVESHAPE | VARIABLE | 100k | MIDI | +9 | 1 | 1 | 1 | 1 | GND | 100u | 100n | THRU | 4.7K | 47K | 4.7K | 47K | 100k | THRU | 100k | 100k | GATE | GATE | 10k | 100n | 100k | 10k | LRN | 4148 | LEARN | CVOUT | GATE | GND | -9 | SW IN | SQ IN | SQ MX | CCW | CVIN | CW | CVOUT | VCO | EXT | OUT | GOUT | GIN | BUFF | CV OUT | 1k | 1k | +9V | 100k | 10k | 100k | 10k | 100k | 10k | 100k | 10k | 1k | 1k | Bufferrzzz! | 100k | TL074 | 1k | 1k | TL074 | 1 | 1 | 10k | 100k | 10k | 100k | 1k | 1k | 200k | 100k | 10k | 100k | Werkstatt | der Pfähler | KB SCALE | v0.9 2015 | SAW | TRI | KB | EG | VCO | LFO | VCO | VCO | LFO | LFO | SQ | SQ | TRIG | GATE | TRIG | GATE | KB | EG | SQ | SAW | TRI | SQ | OUT | OUT | IN | IN | IN | IN | IN | IN | IN | IN | BUFFERED
bPlace: IN | Spare Buffer | Protective Resistors | added off board | OUT | 100n | 100n | 100n | 100n | 100n | 100n | 100n